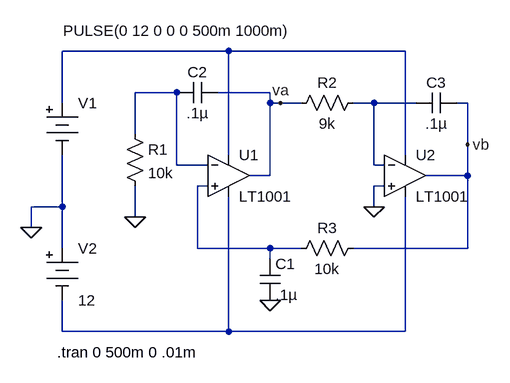
[diagram p0: schematic cuadratura.asc]
cuadratura.asc, the LTspice schematic file:
Version 4
SHEET 1 880 680
WIRE 160 -16 -96 -16
WIRE 432 -16 160 -16
WIRE 80 48 16 48
WIRE 224 48 144 48
WIRE -96 64 -96 -16
WIRE 224 64 224 48
WIRE 240 64 224 64
WIRE 272 64 240 64
WIRE 384 64 352 64
WIRE 448 64 384 64
WIRE 528 64 512 64
WIRE 16 112 16 48
WIRE 528 128 528 64
WIRE 160 144 160 -16
WIRE 432 144 432 -16
WIRE 80 160 80 48
WIRE 128 160 80 160
WIRE 384 160 384 64
WIRE 400 160 384 160
WIRE 224 176 224 64
WIRE 224 176 192 176
WIRE 528 176 528 128
WIRE 528 176 464 176
WIRE 128 192 112 192
WIRE 400 192 384 192
WIRE -96 224 -96 144
WIRE -96 224 -144 224
WIRE 384 224 384 192
WIRE 16 240 16 192
WIRE -144 256 -144 224
WIRE -96 288 -96 224
WIRE 112 288 112 192
WIRE 224 288 112 288
WIRE 272 288 224 288
WIRE 528 288 528 176
WIRE 528 288 352 288
WIRE 224 304 224 288
WIRE -96 416 -96 368
WIRE 160 416 160 208
WIRE 160 416 -96 416
WIRE 432 416 432 208
WIRE 432 416 160 416
FLAG 16 240 0
FLAG 384 224 0
FLAG 224 368 0
FLAG -144 256 0
FLAG 240 64 va
FLAG 528 128 vb
SYMBOL Opamps\\LT1001 160 112 R0
SYMATTR InstName U1
SYMBOL Opamps\\LT1001 432 112 R0
SYMATTR InstName U2
SYMBOL res 0 96 R0
SYMATTR InstName R1
SYMATTR Value 10k
SYMBOL res 368 48 R90
WINDOW 0 0 56 VBottom 2
WINDOW 3 32 56 VTop 2
SYMATTR InstName R2
SYMATTR Value 9k
SYMBOL res 368 272 R90
WINDOW 0 0 56 VBottom 2
WINDOW 3 32 56 VTop 2
SYMATTR InstName R3
SYMATTR Value 10k
SYMBOL cap 208 304 R0
SYMATTR InstName C1
SYMATTR Value .1µ
SYMBOL cap 144 32 R90
WINDOW 0 0 32 VBottom 2
WINDOW 3 32 32 VTop 2
SYMATTR InstName C2
SYMATTR Value .1µ
SYMBOL cap 512 48 R90
WINDOW 0 0 32 VBottom 2
WINDOW 3 32 32 VTop 2
SYMATTR InstName C3
SYMATTR Value .1µ
SYMBOL Misc\\battery -96 48 R0
WINDOW 3 1 -95 Left 2
WINDOW 123 0 0 Left 2
WINDOW 39 0 0 Left 2
SYMATTR Value PULSE(0 12 0 0 0 500m 1000m)
SYMATTR InstName V1
SYMBOL Misc\\battery -96 272 R0
WINDOW 123 0 0 Left 2
WINDOW 39 0 0 Left 2
SYMATTR InstName V2
SYMATTR Value 12
TEXT -104 448 Left 2 !.tran 0 500m 0 .01m

The netlist it stands for:
* cuadratura.asc
XU1 N004 N002 N001 N005 va LT1001  ; pins In+ In- V+ V- OUT
XU2 0 N003 N001 N005 vb LT1001  ; pins In+ In- V+ V- OUT
R1 N002 0 10k
R2 N003 va 9k
R3 vb N004 10k
C1 N004 0 .1µ
C2 va N002 .1µ
C3 vb N003 .1µ
V1 N001 0 PULSE(0 12 0 0 0 500m 1000m)
V2 0 N005 12
.tran 0 500m 0 .01m
.lib LTC.lib
.backanno
.end